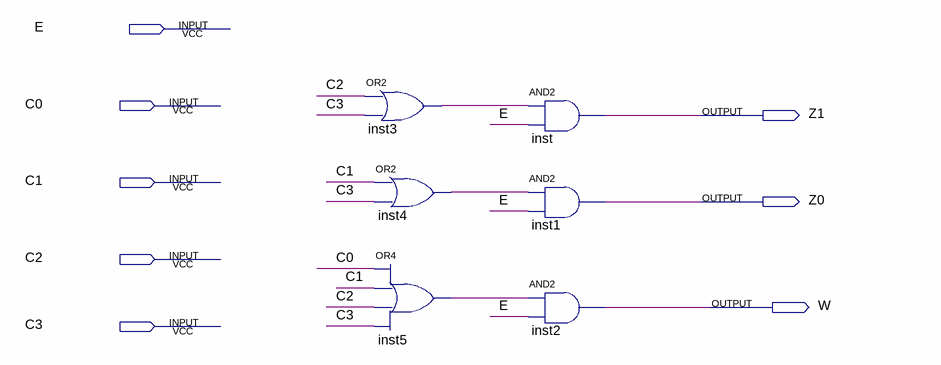
[diagram p0: schematic sheet]
// Quartus schematic MojCD2.bdf as structural Verilog: 6 symbols, 8 pins
module MojCD2 (
  input  E,
  input  C0,
  input  C1,
  input  C2,
  input  C3,
  output Z1,
  output Z0,
  output W
);

  wire inst3_out, inst4_out, inst5_out;

  or inst3 (inst3_out, C2, C3);
  or inst4 (inst4_out, C1, C3);
  or inst5 (inst5_out, C0, C1, C2, C3);
  and inst (Z1, inst3_out, E);
  and inst1 (Z0, inst4_out, E);
  and inst2 (W, inst5_out, E);
endmodule
